# EAGLE design alim_2009 (EAGLE 5.06)
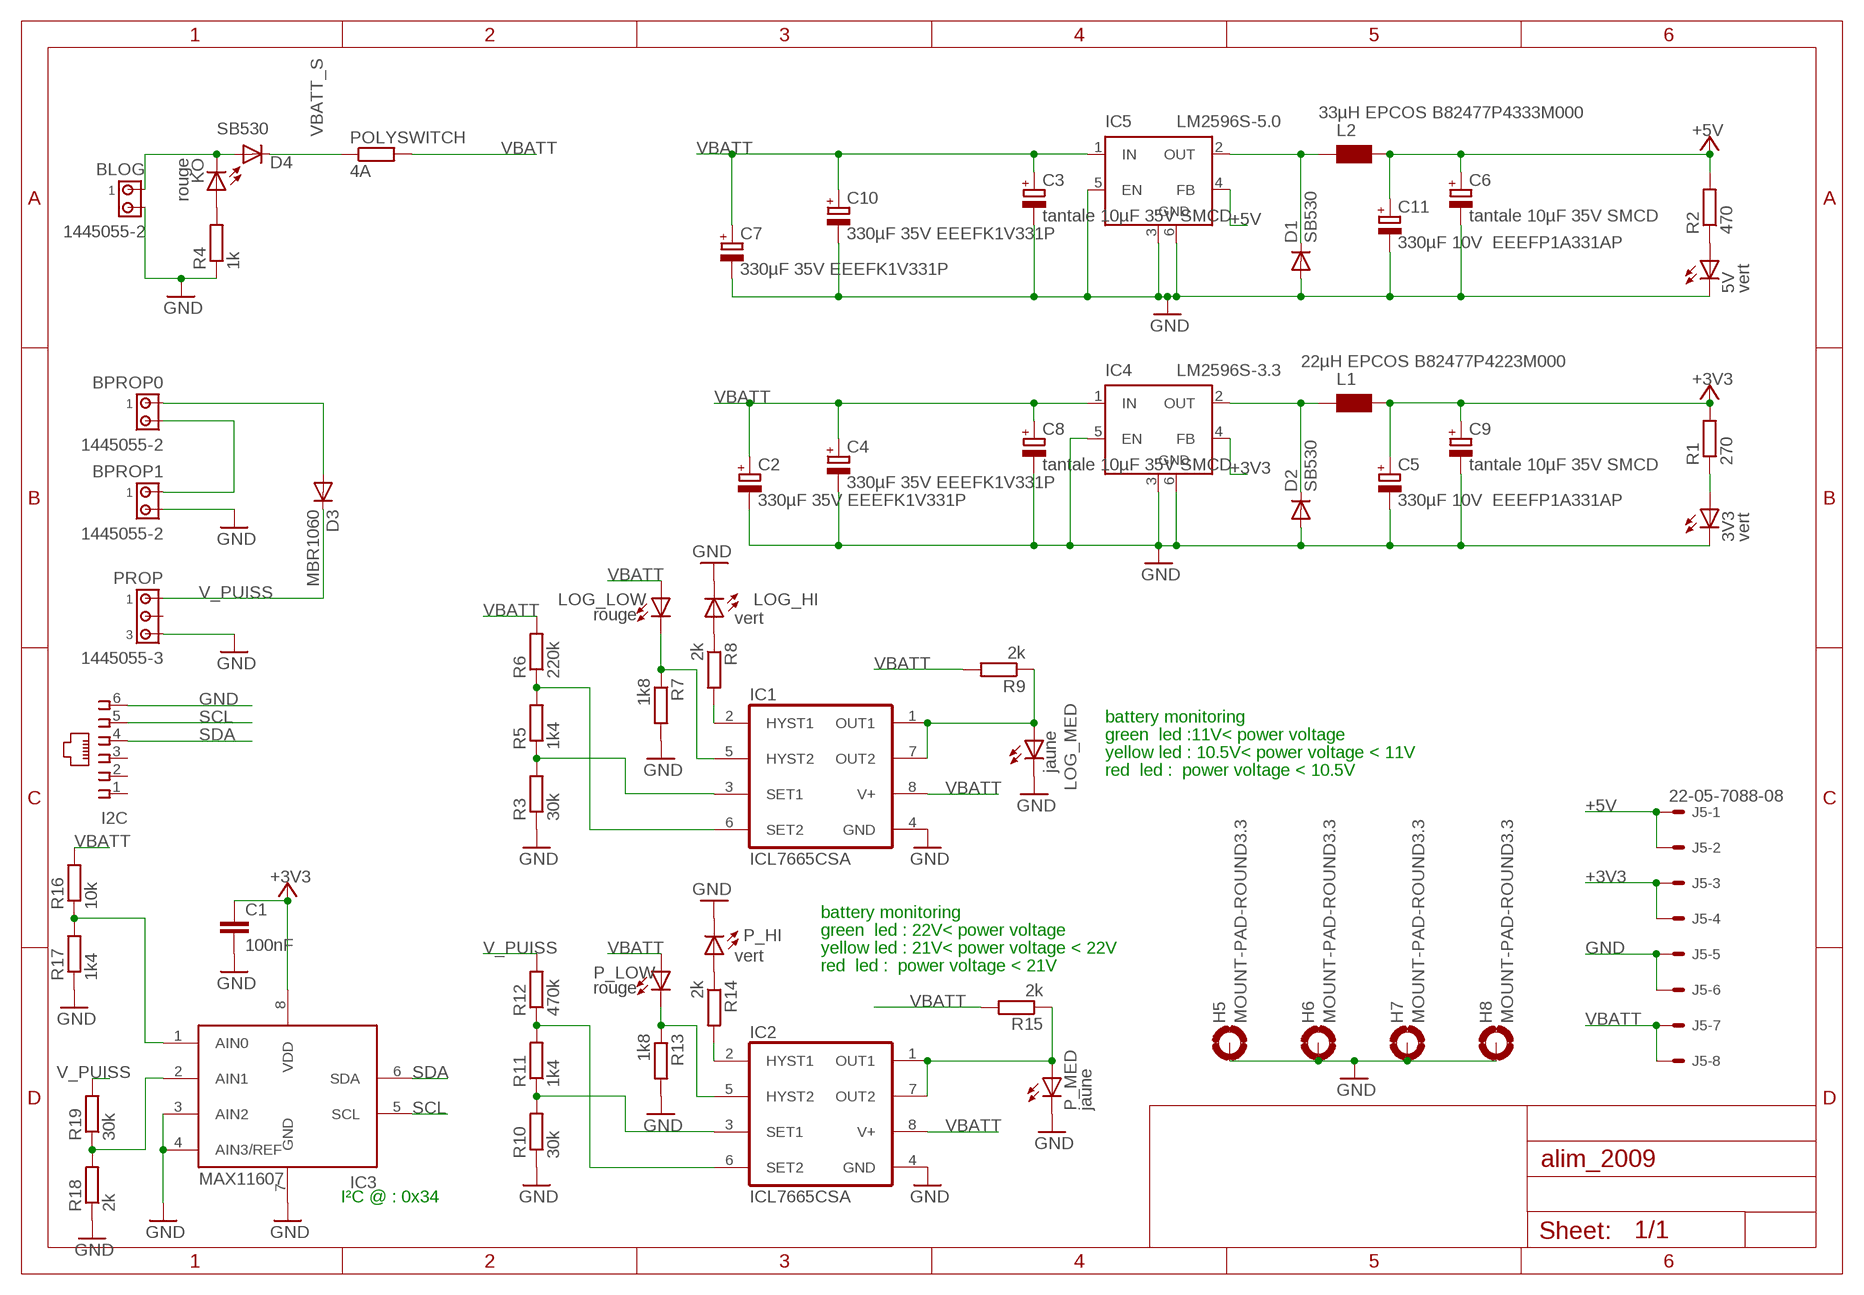
[diagram p0: schematic, sheet 1]

## Parts
3V3  vert  LEDCHIPLED_1206  [CHIPLED_1206]
5V  vert  LEDCHIPLED_1206  [CHIPLED_1206]
BLOG  1445055-2  [1445055-2]
BPROP0  1445055-2  [1445055-2]
BPROP1  1445055-2  [1445055-2]
C1  100nF  C-EUC0805  [C0805]
C2  330µF 35V EEEFK1V331P  CPOL-EUG  [PANASONIC_G]
C3  tantale 10µF 35V SMCD  CPOL-EUSMCD  [SMC_D]
C4  330µF 35V EEEFK1V331P  CPOL-EUG  [PANASONIC_G]
C5  330µF 10V EEEFP1A331AP  CPOL-EUF  [PANASONIC_F]
C6  tantale 10µF 35V SMCD  CPOL-EUSMCD  [SMC_D]
C7  330µF 35V EEEFK1V331P  CPOL-EUG  [PANASONIC_G]
C8  tantale 10µF 35V SMCD  CPOL-EUSMCD  [SMC_D]
C9  tantale 10µF 35V SMCD  CPOL-EUSMCD  [SMC_D]
C10  330µF 35V EEEFK1V331P  CPOL-EUG  [PANASONIC_G]
C11  330µF 10V EEEFP1A331AP  CPOL-EUF  [PANASONIC_F]
D1  SB530  DIODE-DO201-15  [DO201-15]
D2  SB530  DIODE-DO201-15  [DO201-15]
D3  MBR1060  DIODE-TO220H  [TO220AC]
D4  SB530  DIODE-DO201-15  [DO201-15]
H5  MOUNT-PAD-ROUND3.3  [3,3-PAD]
H6  MOUNT-PAD-ROUND3.3  [3,3-PAD]
H7  MOUNT-PAD-ROUND3.3  [3,3-PAD]
H8  MOUNT-PAD-ROUND3.3  [3,3-PAD]
I2C  520250-3  [520250-3]
IC1  ICL7665CSA  [SO08]
IC2  ICL7665CSA  [SO08]
IC3  MAX11607  MAX11606EUA+  [UMAX8]
IC4  LM2596S-3.3  LM2596S  [TO263-5]
IC5  LM2596S-5.0  LM2596S  [TO263-5]
J5  22-05-7088-08  [7395-08]
KO  rouge  LEDCHIPLED_1206  [CHIPLED_1206]
L1  22µH EPCOS B82477P4223M000  WE-PD_L/XL/XXL  [WE-PD_L/XL/XXL]
L2  33µH EPCOS B82477P4333M000  WE-PD_L/XL/XXL  [WE-PD_L/XL/XXL]
LOG_HI  vert  LEDCHIPLED_1206  [CHIPLED_1206]
LOG_LOW  rouge  LEDCHIPLED_1206  [CHIPLED_1206]
LOG_MED  jaune  LEDCHIPLED_1206  [CHIPLED_1206]
P_HI  vert  LEDCHIPLED_1206  [CHIPLED_1206]
P_LOW  rouge  LEDCHIPLED_1206  [CHIPLED_1206]
P_MED  jaune  LEDCHIPLED_1206  [CHIPLED_1206]
POLYSWITCH  4A  R-EU_0207/7  [0207/7]
PROP  1445055-3  [1445055-3]
R1  270  R-EU_M0805  [M0805]
R2  470  R-EU_M0805  [M0805]
R3  30k  R-EU_R0805  [R0805]
R4  1k  R-EU_M0805  [M0805]
R5  1k4  R-EU_R0805  [R0805]
R6  220k  R-EU_R0805  [R0805]
R7  1k8  R-EU_R0805  [R0805]
R8  2k  R-EU_R0805  [R0805]
R9  2k  R-EU_R0805  [R0805]
R10  30k  R-EU_R0805  [R0805]
R11  1k4  R-EU_R0805  [R0805]
R12  470k  R-EU_R0805  [R0805]
R13  1k8  R-EU_R0805  [R0805]
R14  2k  R-EU_R0805  [R0805]
R15  2k  R-EU_R0805  [R0805]
R16  10k  R-EU_R0805  [R0805]
R17  1k4  R-EU_R0805  [R0805]
R18  2k  R-EU_R0805  [R0805]
R19  30k  R-EU_0204/7  [0204/7]

## Nets
+3V3: C1.1 C5.+ C9.+ IC3.8(VDD) IC4.4(FB) J5.3 J5.4 L1.1 R1.2
+5V: C6.+ C11.+ IC5.4(FB) J5.1 J5.2 L2.1 R2.2
GND: 3V3.C 5V.C BLOG.2 BPROP1.2 C1.2 C2.- C3.- C4.- C5.- C6.- C7.- C8.- C9.- C10.- C11.- D1.A D2.A H5.B3,3(MOUNT) H6.B3,3(MOUNT) H7.B3,3(MOUNT) H8.B3,3(MOUNT) I2C.6 IC1.4(GND) IC2.4(GND) IC3.3(AIN2) IC3.4(AIN3/REF) IC3.7(GND) IC4.3(GND) IC4.5(EN) IC4.6(GND) IC5.3(GND) IC5.5(EN) IC5.6(GND) J5.5 J5.6 LOG_HI.C LOG_MED.C P_HI.C P_MED.C PROP.3 R3.1 R4.1 R7.2 R10.1 R13.2 R17.1 R18.1
LOGIC_VOLTAGE_MONITOR: IC3.1(AIN0) R16.1 R17.2
N$1: D2.C IC4.2(OUT) L1.2
N$2: 5V.A R2.1
N$3: BPROP0.2 BPROP1.1
N$4: IC1.3(SET1) R3.2 R5.1
N$5: IC1.6(SET2) R5.2 R6.1
N$6: KO.A R4.2
N$7: BPROP0.1 D3.A
N$8: BLOG.1 D4.A KO.C
N$9: 3V3.A R1.1
N$10: D1.C IC5.2(OUT) L2.2
N$11: IC1.1(OUT1) IC1.7(OUT2) LOG_MED.A R9.1
N$13: IC1.5(HYST2) LOG_LOW.C R7.1
N$14: LOG_HI.A R8.1
N$15: IC1.2(HYST1) R8.2
N$17: IC2.3(SET1) R10.2 R11.1
N$18: IC2.6(SET2) R11.2 R12.1
N$19: IC2.1(OUT1) IC2.7(OUT2) P_MED.A R15.1
N$20: IC2.5(HYST2) P_LOW.C R13.1
N$21: P_HI.A R14.1
N$23: IC2.2(HYST1) R14.2
POWER_VOLTAGE_ONITOR: IC3.2(AIN1) R18.2 R19.1
SCL: I2C.5 IC3.5(SCL)
SDA: I2C.4 IC3.6(SDA)
V_PUISS: D3.C PROP.1 R12.2 R19.2
VBATT: C2.+ C3.+ C4.+ C7.+ C8.+ C10.+ IC1.8(V+) IC2.8(V+) IC4.1(IN) IC5.1(IN) J5.7 J5.8 LOG_LOW.A P_LOW.A POLYSWITCH.2 R6.2 R9.2 R15.2 R16.2
VBATT_S: D4.C POLYSWITCH.1
Unconnected: I2C.1 I2C.2 I2C.3 PROP.2

## Notes on the sheet
- battery monitoring
- green  led :11V< power voltage
- yellow led : 10.5V< power voltage < 11V
- red  led :  power voltage < 10.5V
- battery monitoring
- green  led : 22V< power voltage
- yellow led : 21V< power voltage < 22V
- red  led :  power voltage < 21V
- I²C @ : 0x34

## Library data of the parts
3V3 5V KO LOG_HI LOG_LOW LOG_MED P_HI P_LOW P_MED = led:LED: LED OSRAM: - CHIPLED LG R971, LG N971, LY N971, LG Q971, LY Q971, LO R971, LY R971 LH N974, LH R974 LS Q976, LO Q976, LY Q976 LO Q996 - Hyper CHIPLED LW Q18S LB Q993, LB Q99A, LB R99A - SideLED LS A670, LO A670, LY A670, LG A670, LP A670 LB A673, LV A673, LT A673, LW A673 LH A674 LY A675 LS A676, LA A676, LO A676, LY A676, LW A676 LS A679, LY A679, LG A679 - Hyper Micro SIDELED® LS Y876, LA Y876, LO Y876, LY Y876 LT Y87S - SmartLED LW L88C, LW L88S LB L89C, LB L89S, LG L890 LS L89K, LO L89K, LY L89K LS L896, LA L896, LO L896, LY L896 - TOPLED LS T670, LO T670, LY T670, LG T670, LP T670 LSG T670, LSP T670, LSY T670, LOP T670, LYG T670 LG T671, LOG T671, LSG T671 LB T673, LV T673, LT T673, LW T673 LH T674 LS T676, LA T676, LO T676, LY T676, LB T676, LH T676, LSB T676, LW T676 LB T67C, LV T67C, LT T67C, LS T67K, LO T67K, LY T67K, LW E67C LS E67B, LA E67B, LO E67B, LY E67B, LB E67C, LV E67C, LT E67C LW T67C LS T679, LY T679, LG T679 LS T770, LO T770, LY T770, LG T770, LP T770 LB T773, LV T773, LT T773, LW T773 LH T774 LS E675, LA E675, LY E675, LS T675 LS T776, LA T776, LO T776, LY T776, LB T776 LHGB T686 LT T68C, LB T68C - Hyper Mini TOPLED® LB M676 - Mini TOPLED Santana® LG M470 LS M47K, LO M47K, LY M47K Source: http://www.osram.convergy.de LUXEON: - LUMILED® LXK2-PW12-R00, LXK2-PW12-S00, LXK2-PW14-U00, LXK2-PW14-V00 LXK2-PM12-R00, LXK2-PM12-S00, LXK2-PM14-U00 LXK2-PE12-Q00, LXK2-PE12-R00, LXK2-PE12-S00, LXK2-PE14-T00, LXK2-PE14-U00 LXK2-PB12-K00, LXK2-PB12-L00, LXK2-PB12-M00, LXK2-PB14-N00, LXK2-PB14-P00, LXK2-PB14-Q00 LXK2-PR12-L00, LXK2-PR12-M00, LXK2-PR14-Q00, LXK2-PR14-R00 LXK2-PD12-Q00, LXK2-PD12-R00, LXK2-PD12-S00 LXK2-PH12-R00, LXK2-PH12-S00 LXK2-PL12-P00, LXK2-PL12-Q00, LXK2-PL12-R00 Source: www.luxeon.com KINGBRIGHT: KA-3528ASYC Source: www.kingbright.com
BLOG BPROP0 BPROP1 = con-amp:1445055-2: Micro MATE-N-LOK Connectors grid 1.5 mm Source: ENG_CD_1445055_A.pdf
C1 = rcl:C-EU: CAPACITOR, European symbol
C2-C11 = rcl:CPOL-EU: POLARIZED CAPACITOR, European symbol
D1-D4 = diode:DIODE-: DIODE
H5-H8 = holes:MOUNT-PAD-ROUND: MOUNTING PAD, round
I2C = con-amp:520250-3: AMP connector
IC1 IC2 = maxim:ICL7665CSA: UNDER/OVER VOLTAGE DETECTOR
IC3 = robotter:MAX11606
IC4 IC5 = linear:LM2596S: STEP-DOWN VOLTAGE REGULATOR
J5 = con-molex:22-?-08: CONNECTOR wire to board 2.54 mm (.1 inch) pitch header
L1 L2 = wuerth-elektronik:WE-PD: SMD-Shielded Power Inductors WE-PD Is recommended for the application with switching regulators from National Semiconductor, Linear Technology, Texas Instruments and Fairchild Semiconductor - Magnetically shielded version which results in a low leakage field - High storage capacity - Low self-losses -- Switching regulators with low operating voltages (computer, laptop, mobile phones, pagers) -- Integrated DC/DC-converter
POLYSWITCH R1-R19 = rcl:R-EU_: RESISTOR, European symbol
PROP = con-amp:1445055-3: Micro MATE-N-LOK Connectors grid 1.5 mm Source: ENG_CD_1445055_A.pdf

## Board
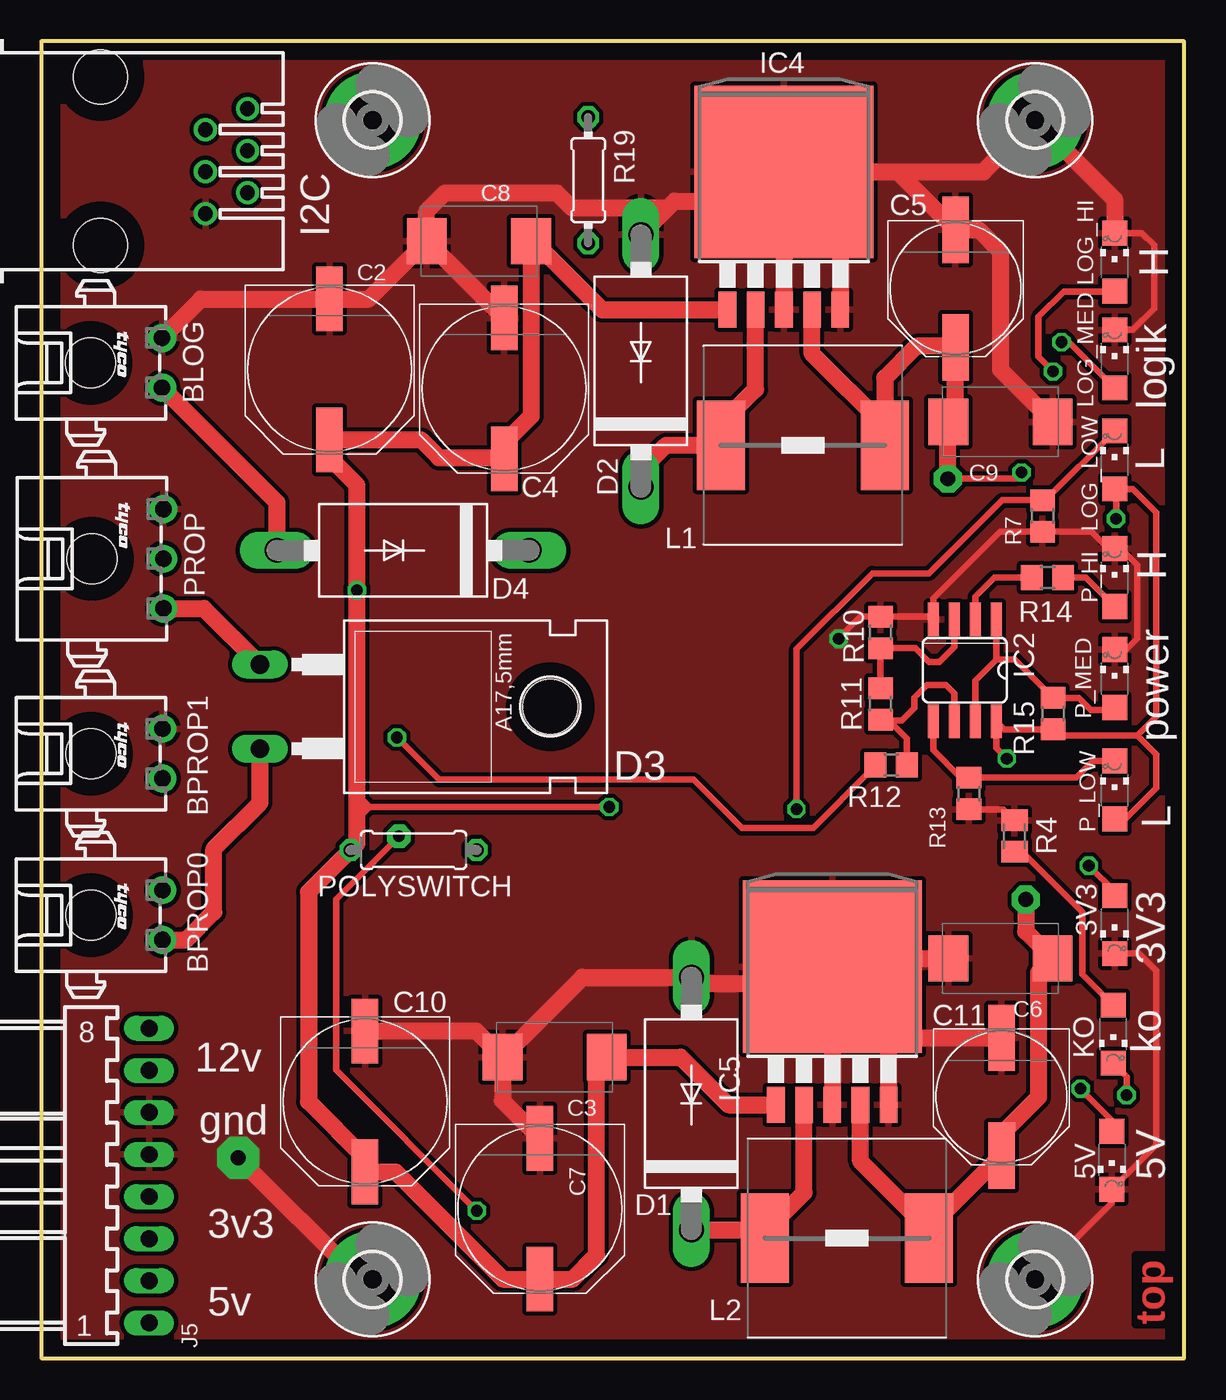
[diagram p1: board, top side]
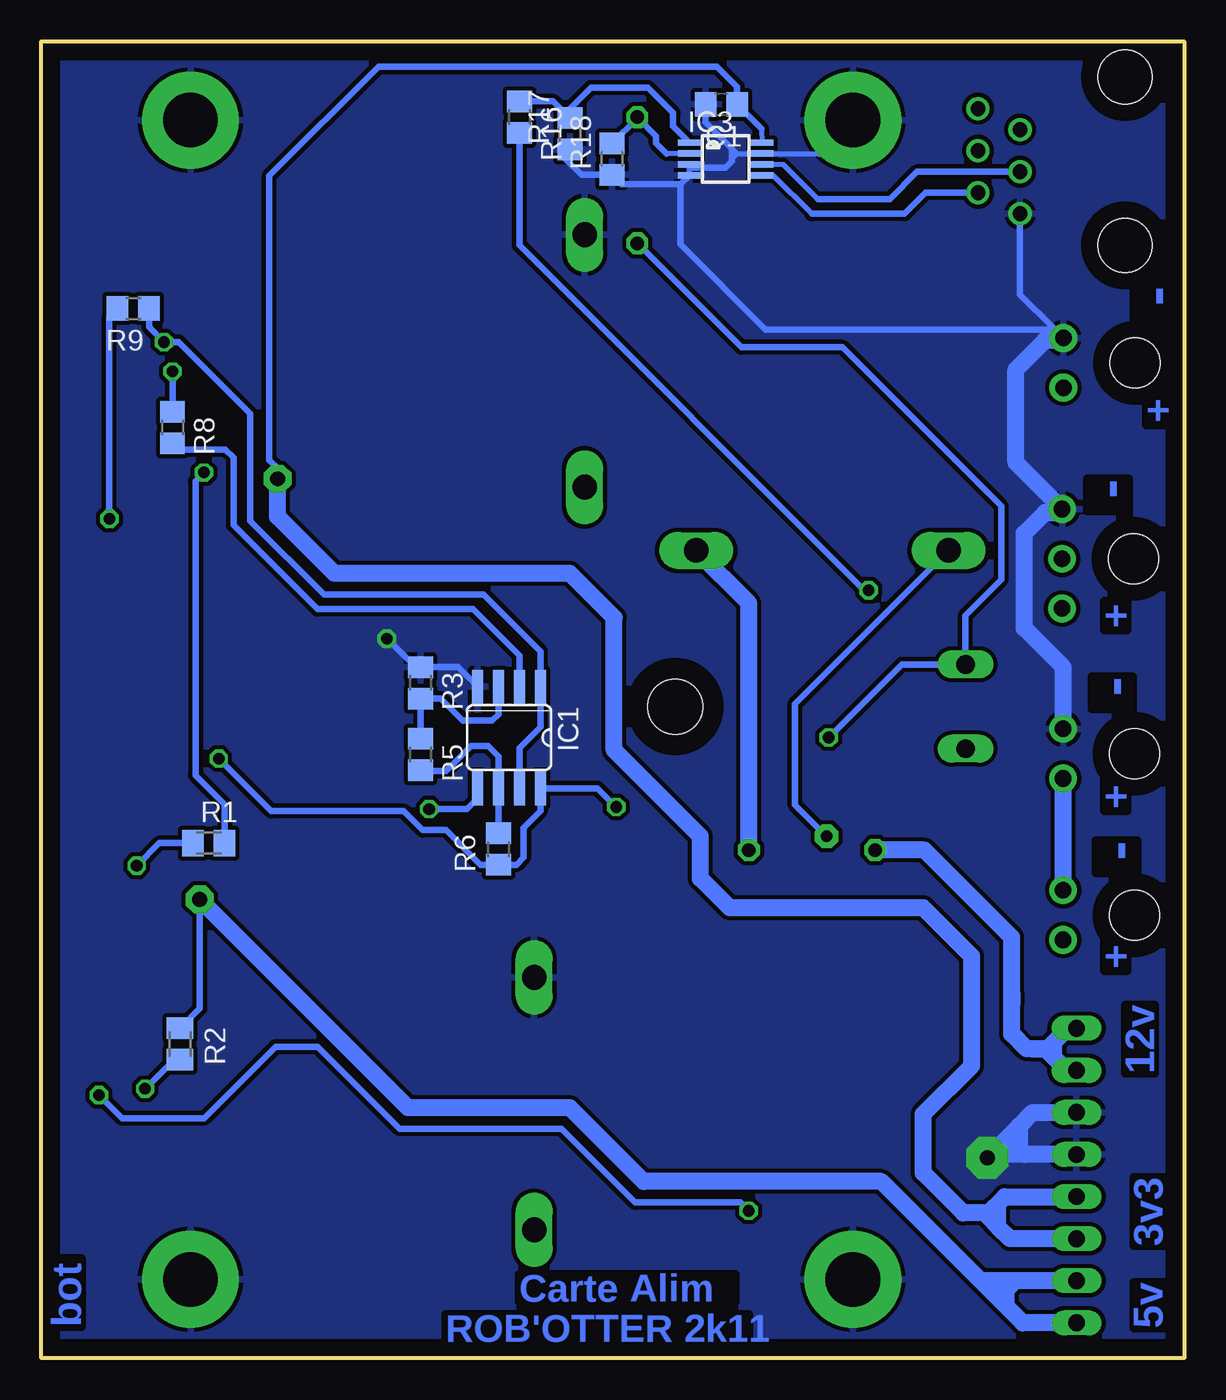
[diagram p2: board, bottom side, seen from below]

Size 69 x 79.5 mm. Coordinates in mm from the lower left corner, seen from the top.
Outline: 0,0 69,0 69,79.5 0,79.5 0,0
Copper layers (1*16): Top 0.035mm / dielectric 1.5mm / Bottom 0.035mm
Design rules "default *": minimum track width 10mil, minimum drill 0.6mm, track to track 10mil, track to pad 10mil, pad to pad 10mil, via to via 10mil, smd to smd 8mil, copper to edge 40mil, drill to drill 8mil, minimum pad ring 10mil, minimum via ring 8mil, stop-mask expansion 4mil, vias tented up to drill 0mil, thermal gap 10mil

### Footprints (pad centres in the part's own frame; a part is rotated, then mirrored left to right if it is on the bottom)
CHIPLED_1206 = smd 1.5 x 1.5: A 0,-1.75; C 0,1.75
1445055-2 = drill 1 pad 1.676 round: 1 1.5,4.32; 2 -1.5,4.32 | hole 3: 0,0
C0805 = smd 1.3 x 1.5: 1 -0.95,0; 2 0.95,0
PANASONIC_G = smd 3.9 x 1.6: + 4.25,0; - -4.25,0
SMC_D = smd 2.4 x 2.8: + -3.15,0; - 3.15,0
PANASONIC_F = smd 4 x 1.6: + 3.55,0; - -3.55,0
DO201-15 = drill 1.499 long: A 7.62,0; C -7.62,0
TO220AC = drill 1.118 long: A 2.54,-6.35; C -2.54,-6.35 | hole 3.302: 0,11.176
3,3-PAD = drill 3.3 pad 5.842 round: B3,3 0,0
520250-3 = drill 0.889 round: 1 -3.175,8.89; 2 -1.905,6.35; 3 -0.635,8.89; 4 0.635,6.35; 5 1.905,8.89; 6 3.175,6.35 | hole 3.251: -5.08,0; 5.08,0
SO08 = smd 0.66 x 2.032: 1 -1.905,-3.073; 2 -0.635,-3.073; 3 0.635,-3.073; 4 1.905,-3.073; 5 1.905,3.073; 6 0.635,3.073; 7 -0.635,3.073; 8 -1.905,3.073
UMAX8 = smd 0.39 x 1.4: 1 -0.99,-2.184; 2 -0.33,-2.184; 3 0.33,-2.184; 4 0.99,-2.184; 5 0.99,2.184; 6 0.33,2.184; 7 -0.33,2.184; 8 -0.99,2.184
TO263-5 = smd 1.067 x 2.159: 1 -3.404,-5.791; 2 -1.702,-5.791; 3 0,-5.791; 4 1.702,-5.791; 5 3.404,-5.791 | smd 10.8 x 10.41: 6 0,2.54
7395-08 = drill 1.016 long: 1 8.89,0; 2 6.35,0; 3 3.81,0; 4 1.27,0; 5 -1.27,0; 6 -3.81,0; 7 -6.35,0; 8 -8.89,0
WE-PD_L/XL/XXL = smd 2.9 x 5.4: 1 -4.95,0; 2 4.95,0
0207/7 = drill 0.813 octagon: 1 -3.81,0; 2 3.81,0
1445055-3 = drill 1 pad 1.676 round: 1 3,4.32; 2 0,4.32; 3 -3,4.32 | hole 3: 0,0
M0805 = smd 1.3 x 1.6: 1 -0.95,0; 2 0.95,0
R0805 = smd 1.3 x 1.5: 1 -0.95,0; 2 0.95,0
0204/7 = drill 0.813 octagon: 1 -3.81,0; 2 3.81,0

### Placement (x,y rotation side)
3V3  64.8,26.17 180 top
5V  64.63,11.95 180 top
BLOG  2.97,60.09 270 top
BPROP0  2.98,26.75 270 top
BPROP1  2.98,36.5 270 top
C1  27.94,75.7 180 bottom
C2  17.4,59.69 270 top
C3  30.99,18.16 180 top
C4  27.94,58.55 270 top
C5  55.2,64.57 270 top
C6  57.91,24.13 180 top
C7  30.1,9.02 270 top
C8  26.42,67.44 180 top
C9  57.91,56.52 0 top
C10  19.54,15.5 270 top
C11  57.97,15.78 270 top
D1  39.24,15.37 90 top
D2  36.2,60.2 90 top
D3  19.55,39.34 270 top
D4  21.84,48.77 180 top
H5  20,4.75 0 top
H6  60,4.75 0 top
H7  20,74.75 0 top
H8  60,74.75 0 top
I2C  3.56,72.27 270 top
IC1  40.77,37.47 180 bottom
IC2  55.75,41.53 180 top
IC3  27.69,72.39 270 bottom
IC4  44.83,69.09 0 top
IC5  47.75,21.09 0 top
J5  6.5,11.02 270 top
KO  64.72,19.56 180 top
L1  45.97,55.12 180 top
L2  48.64,7.24 180 top
LOG_HI  64.8,66.17 0 top
LOG_LOW  64.8,54.23 0 top
LOG_MED  64.8,60.33 0 top
P_HI  64.8,47.12 0 top
P_LOW  64.8,34.29 0 top
P_MED  64.8,41.02 0 top
POLYSWITCH  22.47,30.67 180 top
PROP  3.05,48.26 270 top
R1  58.89,31.09 0 bottom
R2  60.63,18.97 90 bottom
R3  46.1,40.77 270 bottom
R4  58.76,31.52 270 top
R5  46.1,36.45 270 bottom
R6  41.4,30.74 270 bottom
R7  60.45,50.85 270 top
R8  61.09,56.19 270 bottom
R9  63.45,63.38 180 bottom
R10  50.67,43.82 270 top
R11  50.67,39.5 270 top
R12  51.31,35.82 180 top
R13  56.01,34.09 270 top
R14  60.75,47.12 180 top
R15  61.09,38.91 270 top
R16  40.13,74.93 270 bottom
R17  37.08,73.92 90 bottom
R18  34.54,72.39 90 bottom
R19  33.02,71.12 270 top

### Tracks (layer width: path | path; a pad name or v marks a point on that pad's centre or on a via)
+3V3  (via drill 0.7, 0.9 pad 1.68)
  Top 0.406: v54.74,53.09 58.8,53.09 v59.18,53.47
  Top 1.016: 50.92,56.27 L1.1 | 50.92,56.27 46.53,60.66 IC4.4 | 50.92,56.27 50.92,59.18 52.83,61.09 55.13,61.09 C5.+ 55.2,56.96 C9.+ 54.74,56.49 v54.74,53.09
  Bottom 0.305: 25.51,74.22 IC3.8
  Bottom 0.406: 25.51,74.22 C1.1 26.99,76.78 28.19,77.98 48.64,77.98 55.24,71.38 55.24,54.23 54.74,53.73 v54.74,53.09 | R1.2 57.94,33.43 59.69,35.18 59.69,52.96 v59.18,53.47
  Bottom 1.016: J5.3 10.51,7.21 11.24,7.94 | 11.24,7.94 11.87,8.58 | 11.87,8.58 12.06,8.77 13.34,8.77 15.75,11.18 15.75,14.74 12.83,17.66 12.83,24.26 15.75,27.18 27.43,27.18 29.21,28.96 29.21,31.5 34.42,36.71 34.42,44.71 37.08,47.38 51.31,47.38 54.74,50.8 v54.74,53.09 | J5.4 10.83,9.75 11.87,8.7 11.87,8.58 | 11.24,7.94 11.24,9.34
+5V  (via drill 0.9 pad 1.68)
  Top 1.016: 53.59,7.75 L2.1 | 53.59,7.75 49.45,11.89 IC5.4 | 53.59,7.75 53.59,7.86 C11.+ 57.97,13.52 60.2,15.75 60.2,23.27 C6.+ 59.44,25.76 v59.44,27.69
  Bottom 0.406: R2.2 59.44,21.11 v59.44,27.69
  Bottom 1.016: v59.44,27.69 46.86,15.12 37.08,15.12 32.64,10.67 18.29,10.67 12.32,4.7 | J5.1 9.74,2.13 10.73,3.12 | 10.73,3.12 12.32,4.7 | 10.19,4.67 10.73,4.13 10.73,3.12 | J5.2 6.53,4.7 12.32,4.7
GND  (via drill 0.7, 0.9 pad 2.54)
  Top 0.406: v11.89,12.1 12.19,11.94 | 65.03,61.85 LOG_MED.C 64.83,62.11 65.91,62.11 67.18,63.38 67.18,67.19 66.45,67.92 LOG_HI.C | P_MED.C 65.5,42.77 66.17,43.44 66.17,47.88 65.18,48.87 P_HI.C | P_HI.C 65.03,48.65 | P_HI.C 64.52,49.15 | P_HI.C 64.39,49.03 64.39,48.9 63.39,49.9 R7.2 57.9,49.9 53.85,45.85 IC2.4 53.69,44.77 R10.1 49.46,44.77 v48.13,43.44 | 3V3.C 66.26,24.42 67.31,23.37 67.31,12.87 5V.C 64.63,9.38 H6.B3,3 | R4.1 58.09,33.14 R13.2
  Top 1.016: 12.19,12.45 v11.89,12.1 19.24,4.75 | C10.- 26.26,19.75 C3.- | C3.- 27.84,15.53 C7.- | C3.- 32.66,22.99 D1.A 39.62,22.61 47.24,22.61 | 47.24,22.61 IC5.6 47.75,21.85 | 47.75,21.85 IC5.3 | 51.16,21.85 IC5.5 | 47.75,21.85 51.16,21.85 | 51.16,21.85 51.16,24.13 C6.- 55.27,23.6 | C11.- 50.52,19.33 47.24,22.61 | IC4.6 43.05,71.63 43.05,71 41.91,69.85 38.23,69.85 | IC4.6 IC4.3 | 38.23,69.85 D2.A | IC4.5 48.23,71.63 45.59,71.63 | IC4.6 45.59,71.63 | 45.59,71.63 49.53,71.63 | 49.53,71.63 51.69,71.63 C5.- 56.59,68.12 57.91,66.81 57.91,59.67 C9.- | C4.- 23.3,67.44 C8.- | 38.23,69.85 37.85,69.47 32,69.47 31.11,70.36 24.38,70.36 23.27,69.24 C8.- | BLOG.2 9.64,63.94 C2.- 19.77,63.94 C8.- | 49.53,71.63 56.88,71.63 H8.B3,3 64.8,69.95 LOG_HI.C
  Bottom 0.305: 27.3,73.03 27,72.72 | 27,72.72 26.99,72.72 | 29.68,71.89 29.69,71.89 IC3.3 IC3.4 | 22.03,72.72 IC3.7 27,72.72 | 27,72.72 27.3,72.41 27.3,72.39
  Bottom 0.406: IC1.4 43.85,41.72 R3.1 46.42,41.72 v48.13,43.44 | C1.2 28.89,74.61 27.3,73.03 27.3,72.39 27.3,72.27 27.69,71.89 29.68,71.89 | 30.41,70.87 IC3.4 | 30.41,70.87 33.97,70.87 R18.1 36.39,71.44 37.34,72.39 37.34,72.71 R17.1 | 30.41,70.87 30.41,67.24 25.27,62.11 7.8,62.11 BLOG.2 | 22.03,72.72 H7.B3,3 | I2C.6 9.91,64.21 7.9,62.2
  Bottom 1.016: 12.23,11.91 12.45,11.69 12.45,11.8 v11.89,12.1 | BPROP1.2 7.3,41.73 9.65,44.07 9.65,49.79 8.38,51.06 7.57,51.06 PROP.3 10.16,54.06 10.16,59.69 8.38,61.47 7.41,61.47 BLOG.2 | J5.6 9.16,14.83 9.96,14.03 | v11.89,12.1 9.96,14.03 | 9.96,12.63 10.29,12.96 | 9.96,12.63 9.62,12.29 | 9.96,14.03 9.96,12.63 | J5.5 11.7,12.29 v11.89,12.1
  pour Bottom: -0.51,-0.38 -0.51,79.51 68.71,79.51 68.71,-0.38
  pour Top: 69.47,-0.12 69.47,79.76 0,79.76 0,-0.12
LOGIC_VOLTAGE_MONITOR
  Bottom 0.305: IC3.1 29.95,73.38
  Bottom 0.406: R16.1 38.1,75.88 R17.2 37.08,75.44 35.81,76.71 32.38,76.71 30.86,75.19 30.86,74.37 IC3.1
N$1
  Top 1.016: D2.C 36.2,53.6 37.72,55.12 L1.2 41.02,56.4 43.13,58.5 IC4.2
N$2  (via drill 0.7)
  Top 0.406: 5V.A 64.63,14.37 v62.74,16.26
  Bottom 0.406: v62.74,16.26 60.98,18.02 R2.1
N$3
  Bottom 1.016: BPROP0.2 BPROP1.1
N$4
  Bottom 0.406: R5.1 R3.2 44.9,39.82 43.56,38.48 41.78,38.48 41.4,38.87 IC1.3
N$5
  Bottom 0.406: 41.4,31.57 R6.1 IC1.6 41.4,36.33 42.04,36.96 43.05,36.96 44.58,35.44 46.03,35.44 R5.2
N$6
  Top 0.406: KO.A 62.87,23.16 62.87,26.93 59.23,30.57 R4.2
N$7
  Top 1.016: BPROP0.1 8.74,25.25 10.41,26.93 10.41,30.74 13.2,33.52 D3.A
N$8  (via drill 0.7, 0.7 pad 1.42)
  Top 0.406: KO.C 65.53,16.99 v65.53,15.88 | v26.29,8.89 17.78,17.4 17.78,27.69 v21.59,31.5
  Top 1.016: BLOG.1 14.22,51.66 D4.A
  Bottom 0.406: v65.53,15.88 64.14,14.48 59.18,14.48 54.86,18.8 52.32,18.8 47.37,13.85 37.59,13.85 33.15,9.4 26.8,9.4 v26.29,8.89 | D4.A 23.5,39.5 23.5,33.41 v21.59,31.5
N$9  (via drill 0.7)
  Top 0.406: v63.25,29.72 64.8,28.16 3V3.A
  Bottom 0.406: R1.1 61.88,31.09 v63.25,29.72
N$10
  Top 1.016: D1.C 42.55,7.75 L2.2 43.94,6.86 43.94,7.88 46.05,9.99 IC5.2
N$11  (via drill 0.7)
  Top 0.406: LOG_MED.A 62.04,61.34 v61.59,61.34
  Bottom 0.406: IC1.7 40.13,36.83 38.86,38.1 IC1.1 38.86,42.68 42.29,46.1 51.94,46.1 56.39,50.55 56.39,57.03 60.71,61.34 v61.59,61.34 62.5,62.25 R9.1
N$13  (via drill 0.7)
  Top 0.406: LOG_LOW.C 60.62,51.8 R7.1 58.02,51.8 53.59,47.38 50.16,47.38 45.59,42.8 v45.59,33.15
  Bottom 0.406: v45.59,33.15 43.31,33.15 42.8,33.66 42.8,34.27 IC1.5
N$14  (via drill 0.7)
  Top 0.406: LOG_HI.A 64.78,64.39 61.72,64.39 60.2,62.87 60.2,60.46 v61.09,59.57
  Bottom 0.406: R8.1 v61.09,59.57
N$15
  Bottom 0.406: IC1.2 40.13,42.42 42.93,45.22 52.32,45.22 57.4,50.3 57.4,54.36 57.91,54.87 60.72,54.87 R8.2
N$17
  Top 0.406: R11.1 R10.2 52.77,42.87 53.59,42.04 54.23,42.04 55.12,42.93 IC2.3
N$18
  Top 0.406: IC2.6 55.12,40.14 54.61,40.64 53.47,40.64 52.7,39.88 52.7,39.25 51.94,38.48 51.18,38.48 | 51.18,38.48 50.74,38.48 R11.2 | R12.1 52.26,37.41 51.18,38.48
N$19
  Top 0.406: IC2.7 56.39,40.9 57.66,42.17 | 57.66,42.17 IC2.1 | P_MED.A 64.65,39.12 63.37,39.12 62.63,39.86 R15.1 58.78,42.17 57.66,42.17
N$20
  Top 0.406: P_LOW.C 63.47,36.04 62.48,35.06 56.03,35.06 R13.1 55.99,35.06 55.5,35.06 53.85,36.71 IC2.5
N$21
  Top 0.406: R14.1 63.05,47.12 P_HI.A
N$23
  Top 0.406: R14.2 57.53,47.12 56.39,45.98 IC2.2
POWER_VOLTAGE_ONITOR
  Bottom 0.305: IC3.2 31.24,72.72
  Bottom 0.406: R18.2 33.02,74.87 R19.1 31.88,73.79 31.88,73.36 31.24,72.72
SCL
  Bottom 0.305: IC3.5 24.79,71.4 22.48,69.09
  Bottom 0.406: 22.48,69.09 16.89,69.09 15.62,70.36 I2C.5
SDA
  Bottom 0.305: IC3.6 24.18,72.06 22.1,69.98
  Bottom 0.406: 22.1,69.98 17.78,69.98 16.13,71.63 I2C.4
V_PUISS  (via drill 0.7)
  Top 0.406: R12.2 50.04,35.82 50.04,35.44 46.61,32.01 42.29,32.01 39.37,34.93 24,34.93 v21.46,37.47
  Top 1.016: D3.C 9.81,45.26 PROP.1
  Bottom 0.406: R19.2 26.73,61.03 20.64,61.03 11.05,51.44 11.05,46.99 13.2,44.84 D3.C 17.05,41.88 v21.46,37.47
VBATT  (via drill 0.7)
  Top 0.406: 64.27,32.39 P_LOW.A 64.83,32.52 65.41,32.52 67.31,34.42 67.31,36.45 66.17,37.6 | LOG_LOW.A 64.65,52.33 64.52,52.45 | 66.17,37.6 61.33,37.6 R15.2 58.16,37.96 IC2.8 57.66,36.83 v58.29,36.2 | 66.17,37.6 66.23,37.66 | 66.23,37.66 66.29,37.72 | 66.23,37.66 67.31,38.74 67.31,51.06 65.89,52.48 LOG_LOW.A | v64.9,50.68 64.9,52.39 LOG_LOW.A | 19.05,33.53 19.05,33.28 | 19.81,33.28 19.05,34.04 | 19.81,33.28 19.05,32.52 19.05,32.13 | 19.81,33.28 v34.29,33.28
  Top 1.016: IC4.1 33.86,63.3 29.72,67.44 C8.+ 29.59,67.42 29.59,56.9 27.94,55.25 C4.+ 27.88,54.36 24,54.36 22.92,55.44 C2.+ 17.4,54.36 19.05,52.71 v19.05,46.36 19.05,34.04 19.05,33.53 19.05,32.13 19.05,31.06 POLYSWITCH.2 16.13,28.14 16.13,15.5 19.56,12.07 19.56,11.26 C10.+ 21.4,11.24 27.87,4.77 C7.+ 32.07,4.77 33.53,6.23 33.53,17.55 C3.+ 38.61,18.16 41.48,15.29 IC5.1
  Bottom 0.406: v58.29,36.2 55.12,33.02 47.12,33.02 45.97,31.88 44.58,31.88 42.48,29.79 R6.2 | v64.9,50.68 64.9,62.88 R9.2 | R16.2 40.13,67.19 19.3,46.36 v19.05,46.36 | v34.29,33.28 35.41,34.4 IC1.8 38.86,33.02 39.88,32.01 39.88,30.23 40.32,29.79 R6.2 | R6.2 41.46,29.85
  Bottom 1.016: 10.41,22.1 10.41,21.34 | 10.41,22.1 10.41,25.4 15.68,30.67 POLYSWITCH.2 | 10.41,22.1 10.41,19.56 9.53,18.67 9.27,18.67 | 9.27,18.67 8.26,18.67 7.87,19.05 | 7.87,19.05 7.02,19.91 J5.8 | J5.7 7.08,17.37 7.87,18.16 | 7.87,18.16 7.87,19.05 | 7.87,18.16 8.38,18.67 9.27,18.67
VBATT_S
  Bottom 1.016: POLYSWITCH.1 26.28,45.59 D4.C

### Text on the board
Top: top
Bottom: - | + | - | + | - | + | - | + | 12v | 3v3 | 5v | Carte Alim | bot | ROB'OTTER 2k11
tPlace: H | logik | L | H | power | L | 3V3 | ko | 12v | gnd | 5V | 3v3 | 5v